# EAGLE design example (EAGLE 9.6.2)
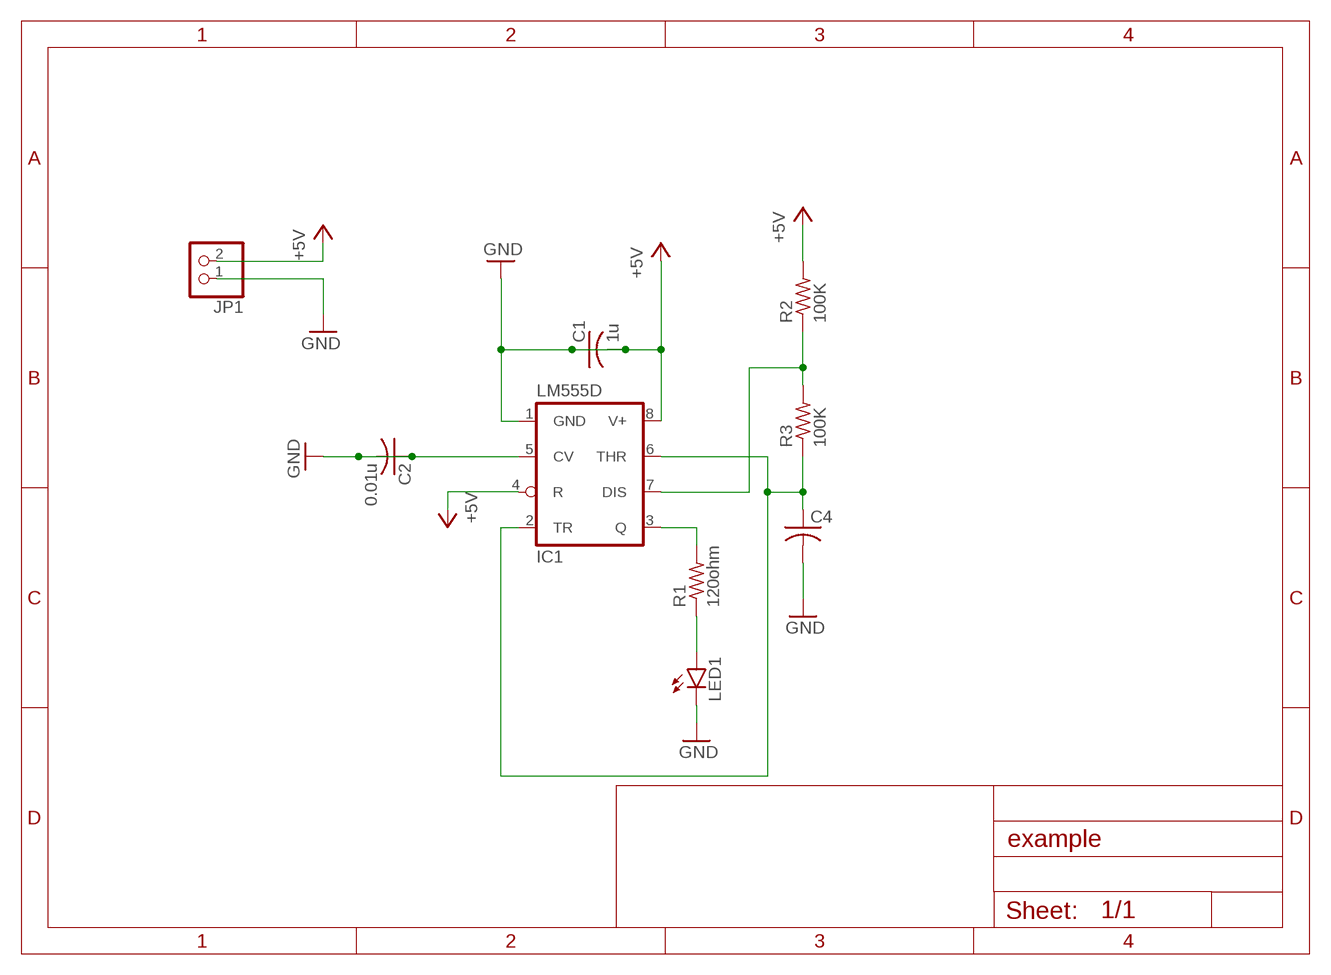
[diagram p0: schematic, sheet 1]

## Parts
C1  1u  C-USC0805  [C0805]
C2  0.01u  C-USC0805  [C0805]
C4  C-USC0805  [C0805]
IC1  LM555D  [SO08]
JP1  PINHD-1X2  [1X02]
LED1  LED5MM  [LED5MM]
R1  120ohm  R-US_M0805  [M0805]
R2  100K  R-US_M0805  [M0805]
R3  100K  R-US_M0805  [M0805]

## Nets
+5V: C1.1 C1.2 IC1.1(GND) IC1.4(R) IC1.8(V+) JP1.2 R2.2 ; supply symbol labelled GND
GND: C2.1 C2.2 C4.2 IC1.5(CV) JP1.1 LED1.K(C)
N$2: IC1.7(DIS) R2.1 R3.2
N$3: IC1.3(Q) R1.2
N$4: LED1.A R1.1
N$5: C4.1 IC1.2(TR) IC1.6(THR) R3.1

## Library data of the parts
C1 C2 C4 = rcl:C-US: CAPACITOR, American symbol; SPICEPREFIX: C
IC1 = linear:*555: TIMER
JP1 = pinhead:PINHD-1X2: PIN HEADER
LED1 = led:LED: LED OSRAM: - CHIPLED LG R971, LG N971, LY N971, LG Q971, LY Q971, LO R971, LY R971 LH N974, LH R974 LS Q976, LO Q976, LY Q976 LO Q996 - Hyper CHIPLED LW Q18S LB Q993, LB Q99A, LB R99A - SideLED LS A670, LO A670, LY A670, LG A670, LP A670 LB A673, LV A673, LT A673, LW A673 LH A674 LY A675 LS A676, LA A676, LO A676, LY A676, LW A676 LS A679, LY A679, LG A679 - Hyper Micro SIDELED® LS Y876, LA Y876, LO Y876, LY Y876 LT Y87S - SmartLED LW L88C, LW L88S LB L89C, LB L89S, LG L890 LS L89K, LO L89K, LY L89K LS L896, LA L896, LO L896, LY L896 - TOPLED LS T670, LO T670, LY T670, LG T670, LP T670 LSG T670, LSP T670, LSY T670, LOP T670, LYG T670 LG T671, LOG T671, LSG T671 LB T673, LV T673, LT T673, LW T673 LH T674 LS T676, LA T676, LO T676, LY T676, LB T676, LH T676, LSB T676, LW T676 LB T67C, LV T67C, LT T67C, LS T67K, LO T67K, LY T67K, LW E67C LS E67B, LA E67B, LO E67B, LY E67B, LB E67C, LV E67C, LT E67C LW T67C LS T679, LY T679, LG T679 LS T770, LO T770, LY T770, LG T770, LP T770 LB T773, LV T773, LT T773, LW T773 LH T774 LS E675, LA E675, LY E675, LS T675 LS T776, LA T776, LO T776, LY T776, LB T776 LHGB T686 LT T68C, LB T68C - Hyper Mini TOPLED® LB M676 - Mini TOPLED Santana® LG M470 LS M47K, LO M47K, LY M47K Source: http://www.osram.convergy.de LUXEON: - LUMILED® LXK2-PW12-R00, LXK2-PW12-S00, LXK2-PW14-U00, LXK2-PW14-V00 LXK2-PM12-R00, LXK2-PM12-S00, LXK2-PM14-U00 LXK2-PE12-Q00, LXK2-PE12-R00, LXK2-PE12-S00, LXK2-PE14-T00, LXK2-PE14-U00 LXK2-PB12-K00, LXK2-PB12-L00, LXK2-PB12-M00, LXK2-PB14-N00, LXK2-PB14-P00, LXK2-PB14-Q00 LXK2-PR12-L00, LXK2-PR12-M00, LXK2-PR14-Q00, LXK2-PR14-R00 LXK2-PD12-Q00, LXK2-PD12-R00, LXK2-PD12-S00 LXK2-PH12-R00, LXK2-PH12-S00 LXK2-PL12-P00, LXK2-PL12-Q00, LXK2-PL12-R00 Source: www.luxeon.com KINGBRIGHT: KA-3528ASYC Source: www.kingbright.com
R1-R3 = rcl:R-US_: RESISTOR, American symbol; SPICEPREFIX: R

## Board
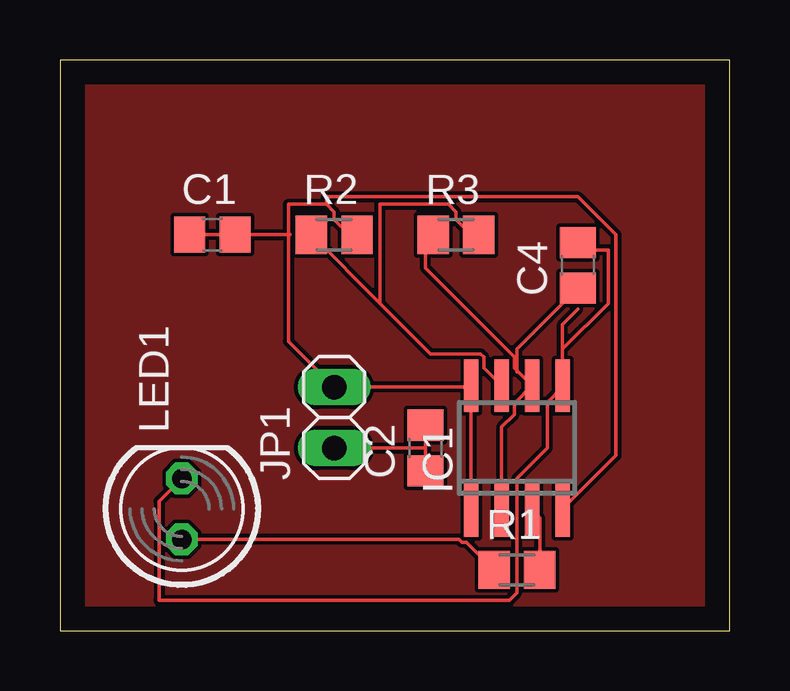
[diagram p1: board, top side]
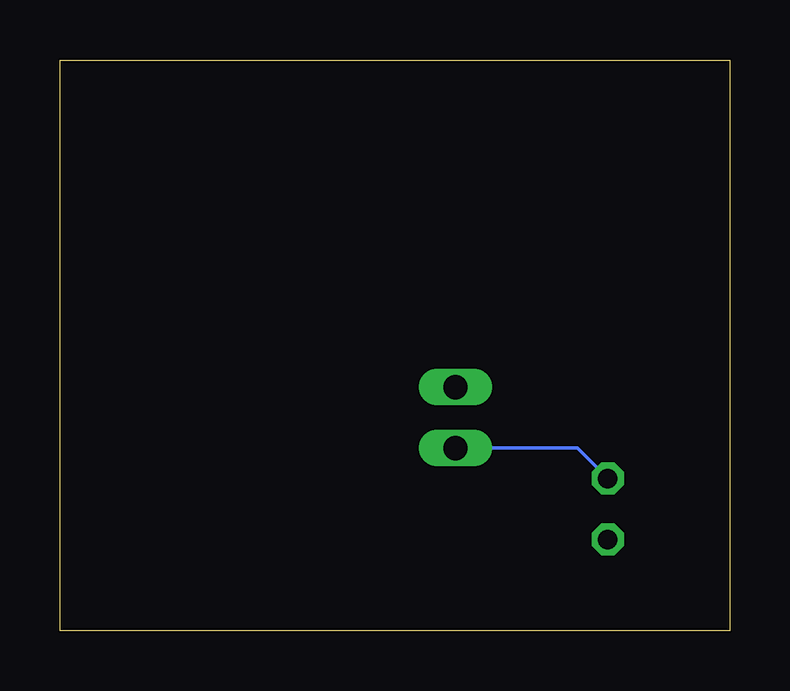
[diagram p2: board, bottom side, seen from below]

Size 27.92 x 23.8 mm. Coordinates in mm from the lower left corner, seen from the top.
Outline: 0,0 27.92,0 27.92,23.8 0,23.8 0,0
Copper layers (1*16): Top 0.035mm / dielectric 1.5mm / Bottom 0.035mm
Design rules "default": minimum track width 6mil, minimum drill 0.35mm, track to track 6mil, track to pad 6mil, pad to pad 6mil, via to via 6mil, smd to smd 6mil, copper to edge 40mil, drill to drill 6mil, minimum pad ring 10mil, minimum via ring 8mil, stop-mask expansion 4mil, vias tented up to drill 0mil, thermal gap 10mil

### Footprints (pad centres in the part's own frame; a part is rotated, then mirrored left to right if it is on the bottom)
C0805 = smd 1.3 x 1.5: 1 -0.95,0; 2 0.95,0
SO08 = smd 0.6 x 2.2: 1 -1.905,-2.6; 2 -0.635,-2.6; 3 0.635,-2.6; 4 1.905,-2.6; 5 1.905,2.6; 6 0.635,2.6; 7 -0.635,2.6; 8 -1.905,2.6
1X02 = drill 1.016 long: 1 -1.27,0; 2 1.27,0
LED5MM = drill 0.813 octagon: A -1.27,0; K 1.27,0
M0805 = smd 1.3 x 1.6: 1 -0.95,0; 2 0.95,0

### Placement (x,y rotation side)
C1  6.35,16.51 0 top
C2  15.24,7.62 90 top
C4  21.59,15.24 90 top
IC1  19.05,7.62 0 top
JP1  11.43,8.89 90 top
LED1  5.08,5.08 90 top
R1  19.05,2.54 0 top
R2  11.43,16.51 0 top
R3  16.51,16.51 0 top

### Tracks (layer width: path | path; a pad name or v marks a point on that pad's centre or on a via)
+5V
  Top 0.152: 9.53,16.51 C1.2 C1.1 | 9.53,16.51 9.6,16.51 | 17.14,10.16 IC1.1 | 17.14,10.16 JP1.2 9.53,12.06 9.53,16.51 | 17.14,10.16 IC1.8 | 11.11,17.78 11.43,17.46 11.43,17.14 12.06,16.51 R2.2 | 11.11,17.78 9.53,17.78 9.53,16.51 | 11.11,17.78 11.11,18.1 21.59,18.1 23.18,16.51 23.18,7.3 20.95,5.08 IC1.4
GND
  Top 0.152: 20.95,11.75 IC1.5 20.95,10.16 20.32,9.53 20.32,7.62 19.05,6.35 19.05,1.59 18.73,1.27 4.13,1.27 4.13,5.4 LED1.K | 20.95,11.75 20.95,12.78 21.59,13.41 | 20.95,11.75 22.86,13.65 22.86,15.88 21.59,15.88 C4.2 | C2.2 15.24,7.62 | 15.24,7.62 C2.1 | JP1.1 15.24,7.62
  Bottom 0.152: LED1.K 6.35,7.62 JP1.1
GROUND
  pour Top: 0,24.13 27.94,24.13 27.94,0 0,0
N$2
  Top 0.152: IC1.7 17.67,10.96 17.67,11.41 17.54,11.55 15.44,11.55 13.34,13.65 | 13.34,13.65 R2.1 | R3.2 17.14,16.51 16.51,17.14 16.51,17.46 16.19,17.78 13.34,17.78 13.34,13.65
N$3
  Top 0.152: R1.2 20,4.71 IC1.3
N$4
  Top 0.152: R1.1 16.95,3.69 16.75,3.69 16.63,3.81 LED1.A
N$5
  Top 0.152: 19.08,10.82 IC1.6 18.94,9.48 18.94,9.03 18.41,8.5 IC1.2 | 19.08,10.82 18.94,10.96 18.94,11.41 15.24,15.12 15.24,16.51 R3.1 | C4.1 19.05,11.75 19.05,10.79 19.08,10.82